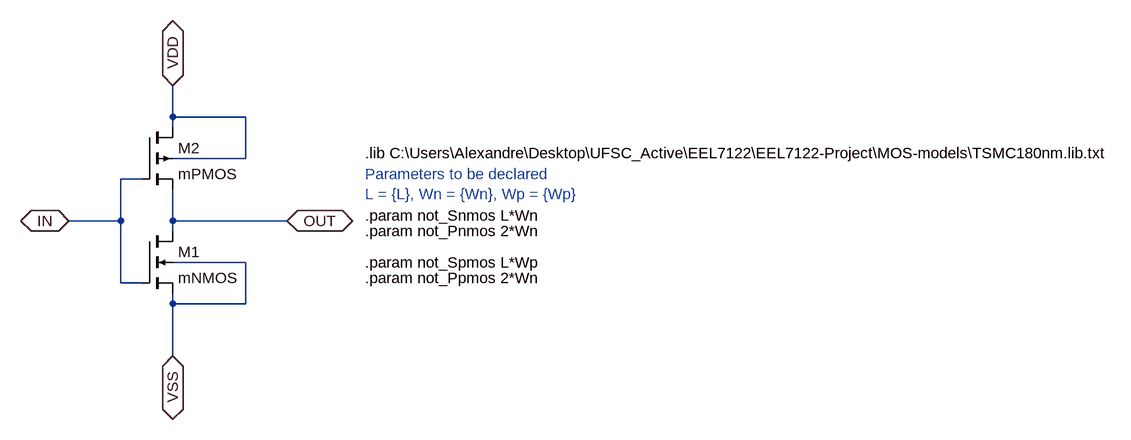
[diagram p0: schematic NOT_CELL.asc]
NOT_CELL.asc, the LTspice schematic file:
Version 4
SHEET 1 1132 680
WIRE -592 -32 -592 -80
WIRE -480 -32 -592 -32
WIRE -592 -16 -592 -32
WIRE -480 32 -480 -32
WIRE -480 32 -592 32
WIRE -640 64 -672 64
WIRE -672 128 -672 64
WIRE -672 128 -752 128
WIRE -592 128 -592 80
WIRE -416 128 -592 128
WIRE -592 144 -592 128
WIRE -480 192 -592 192
WIRE -672 224 -672 128
WIRE -640 224 -672 224
WIRE -592 256 -592 240
WIRE -480 256 -480 192
WIRE -480 256 -592 256
WIRE -592 336 -592 256
FLAG -752 128 IN
IOPIN -752 128 BiDir
FLAG -416 128 OUT
IOPIN -416 128 BiDir
FLAG -592 336 VSS
IOPIN -592 336 BiDir
FLAG -592 -80 VDD
IOPIN -592 -80 BiDir
SYMBOL nmos4 -640 144 R0
SYMATTR InstName M1
SYMATTR Value mNMOS
SYMATTR Value2 l={L} w={Wn} ad={not_Snmos} as={not_Snmos} pd={not_Pnmos} ps={not_Pnmos} m=1
SYMBOL pmos4 -640 -16 R0
SYMATTR InstName M2
SYMATTR Value mPMOS
SYMATTR Value2 l={L} w={WP} ad={not_Spmos} as={not_Spmos} pd={not_Ppmos} ps={not_Ppmos} m=1
TEXT -296 24 Left 2 !.lib C:\\Users\\Alexandre\\Desktop\\UFSC_Active\\EEL7122\\EEL7122-Project\\MOS-models\\TSMC180nm.lib.txt
TEXT -296 192 Left 2 !.param not_Spmos L*Wp
TEXT -296 216 Left 2 !.param not_Ppmos 2*Wn
TEXT -296 120 Left 2 !.param not_Snmos L*Wn
TEXT -296 144 Left 2 !.param not_Pnmos 2*Wn
TEXT -296 56 Left 2 ;Parameters to be declared\nL = {L}, Wn = {Wn}, Wp = {Wp}

The netlist it stands for:
* NOT_CELL.asc
M1 OUT IN VSS VSS mNMOS l={L} w={Wn} ad={not_Snmos} as={not_Snmos} pd={not_Pnmos} ps={not_Pnmos} m=1
M2 VDD IN OUT VDD mPMOS l={L} w={WP} ad={not_Spmos} as={not_Spmos} pd={not_Ppmos} ps={not_Ppmos} m=1
.model NMOS NMOS
.model PMOS PMOS
.lib standard.mos
.lib C:\Users\Alexandre\Desktop\UFSC_Active\EEL7122\EEL7122-Project\MOS-models\TSMC180nm.lib.txt
.param not_Spmos L*Wp
.param not_Ppmos 2*Wn
.param not_Snmos L*Wn
.param not_Pnmos 2*Wn
* Parameters to be declared
* L = {L}, Wn = {Wn}, Wp = {Wp}
.backanno
.end